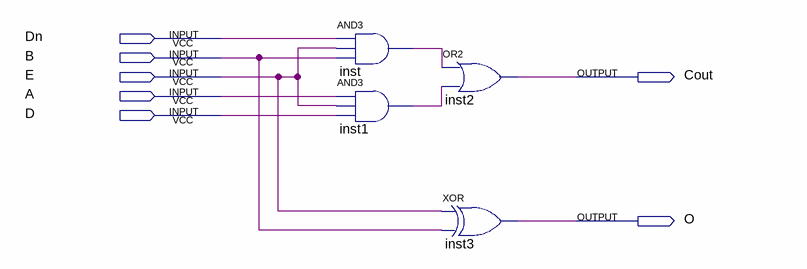
[diagram p0: schematic sheet]
// Quartus schematic HAS.bdf as structural Verilog: 4 symbols, 7 pins
module HAS (
  input  Dn,
  input  B,
  input  E,
  input  A,
  input  D,
  output Cout,
  output O
);

  wire inst1_out, inst_out;

  and inst (inst_out, Dn, E, B);
  and inst1 (inst1_out, A, E, D);
  or inst2 (Cout, inst_out, inst1_out);
  xor inst3 (O, E, B);
endmodule
